# EAGLE design CableAdapter (EAGLE 6.5.0)
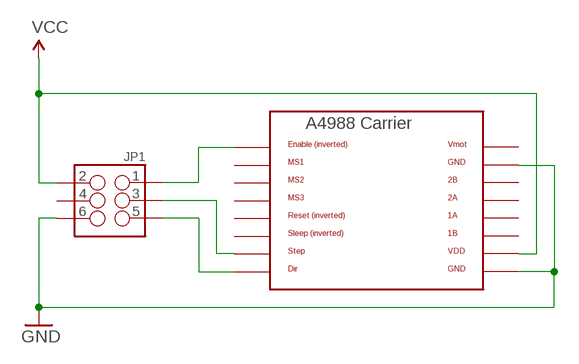
[diagram p0: schematic, sheet 1]

## Parts
JP1  M03X2SHROUD  [2X3-SHROUDED]
U$1  A4988BREAKOUT  [A4988BREAKOUT]

## Nets
GND: JP1.6 U$1.GND U$1.GND@0(GND)
N$1: JP1.1 U$1.EN
N$2: JP1.5 U$1.DIR
N$3: JP1.3 U$1.STEP
VCC: JP1.2 U$1.VDD
Unconnected: JP1.4 U$1.1A U$1.1B U$1.2A U$1.2B U$1.MS1 U$1.MS2 U$1.MS3 U$1.RST U$1.SLP(SLEEP)

## Power pins joined to a net without a drawn wire
VMOT: U$1.VMOT

## Library data of the parts
JP1 = SparkFun-Connectors:M03X2: 2x3 .1" header. Shrouded, with keying- CONN-10681 SMT- CONN-11415 Pogo pins- HW-11044; PROD_ID: CONN-10681
U$1 = RepRapjr:A4988BREAKOUT

## Board
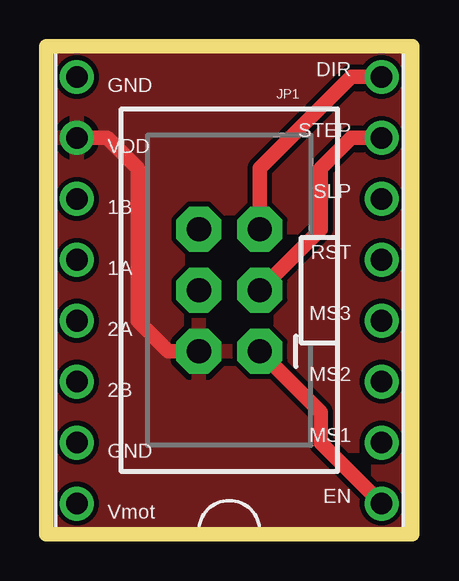
[diagram p1: board, top side]
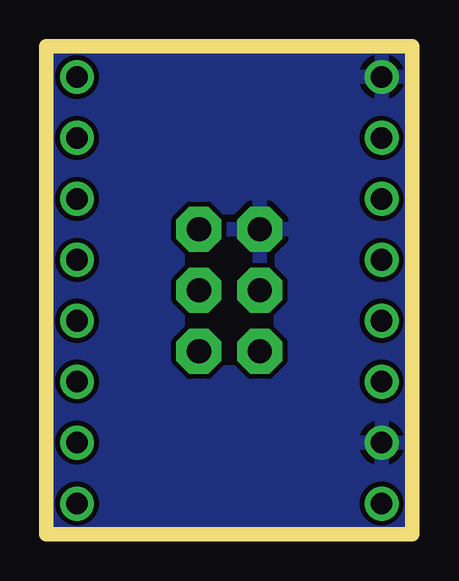
[diagram p2: board, bottom side, seen from below]

No outline drawn. Coordinates in mm, seen from the top.
Copper layers (1*16): Top 0.035mm / dielectric 1.5mm / Bottom 0.035mm
Design rules "default": minimum track width 10mil, minimum drill 24mil, track to track 8mil, track to pad 8mil, pad to pad 8mil, via to via 8mil, smd to smd 8mil, copper to edge 40mil, drill to drill 8mil, minimum pad ring 10mil, minimum via ring 8mil, stop-mask expansion 4mil, vias tented up to drill 0mil, thermal gap 10mil
Milling: 4 lines

### Footprints (pad centres in the part's own frame; a part is rotated, then mirrored left to right if it is on the bottom)
2X3-SHROUDED = drill 1.016 pad 1.88 octagon: 1 -1.27,2.54; 2 1.27,2.54; 3 -1.27,0; 4 1.27,0; 5 -1.27,-2.54; 6 1.27,-2.54
A4988BREAKOUT = drill 0.9: 1A 8.89,1.27; 1B 11.43,1.27; 2A 6.35,1.27; 2B 3.81,1.27; DIR 16.51,-11.43; EN -1.27,-11.43; GND 16.51,1.27; GND@0 1.27,1.27; MS1 1.27,-11.43; MS2 3.81,-11.43; MS3 6.35,-11.43; RST 8.89,-11.43; SLP 11.43,-11.43; STEP 13.97,-11.43; VDD 13.97,1.27; VMOT -1.27,1.27

### Placement (x,y rotation side)
JP1  6.35,8.89 180 top
U$1  1.27,1.27 90 top

### Tracks (layer width: path | path; a pad name or v marks a point on that pad's centre or on a via)
GND
  pour Bottom: -1.27,19.05 13.97,19.05 13.97,-1.27 -1.27,-1.27
N$1
  Top 0.61: JP1.1 10.16,3.81 10.16,2.54 U$1.EN
N$2
  Top 0.61: JP1.5 7.62,13.97 11.43,17.78 U$1.DIR
N$3
  Top 0.61: JP1.3 10.16,11.43 10.16,13.97 11.43,15.24 U$1.STEP
VCC
  Top 0.61: U$1.VDD 1.27,15.24 2.54,13.97 2.54,7.62 3.81,6.35 JP1.2
  pour Top: -1.27,19.05 13.97,19.05 13.97,-1.27 -1.27,-1.27